# Altium schematic sheet Pressure_Transducer.SchDoc
size A
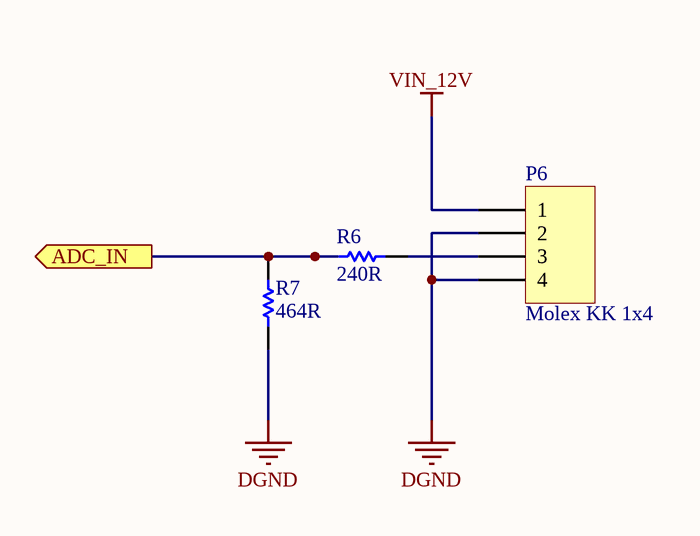
[diagram p0: Pressure_Transducer.SchDoc]

## Parts
P6  Molex KK 1x4  [Molex KK 4x1]
R6  240R  [R0805]
R7  464R  [R0805]

## Ports
ADC_IN (out)

## Nets
DGND: P6.2 P6.4 R7.1
VIN_12V: P6.1
ADC_IN: R6.2 R7.2 ; port ADC_IN
NetP6_3: P6.3 R6.1

## Library data of the parts
P6 = Molex KK 1x4: 1x4 Molex KK Connector
R6 R7 = R0805: RESISTOR 0805
  R6: Value: 240R
  R7: Value: 464R